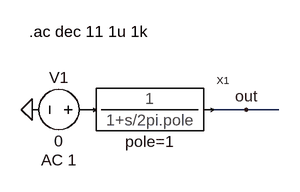
[diagram p0: schematic tb_pole.asc]
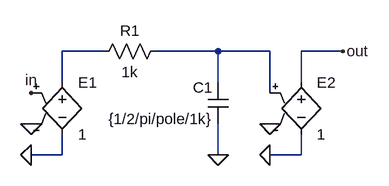
[diagram p1: sub-circuit pole.asc]
tb_pole.asc, the LTspice schematic file:
Version 4
SHEET 1 880 680
WIRE 176 112 128 112
WIRE 224 112 176 112
FLAG -144 112 0
FLAG 176 112 out
SYMBOL pole 32 112 R0
SYMATTR InstName X1
SYMBOL voltage -48 112 R90
WINDOW 0 -32 56 VBottom 2
WINDOW 3 32 56 VTop 2
WINDOW 123 60 56 VTop 2
WINDOW 39 0 0 Left 2
SYMATTR InstName V1
SYMATTR Value 0
SYMATTR Value2 AC 1
TEXT -148 -4 Left 2 !.ac dec 11 1u 1k

pole.asc, the sub-circuit schematic file:
Version 4
SHEET 1 880 680
WIRE 304 64 240 64
WIRE 480 64 384 64
WIRE 560 64 480 64
WIRE 672 64 608 64
WIRE 240 112 240 64
WIRE 480 112 480 64
WIRE 608 112 608 64
WIRE 560 128 560 64
WIRE 240 224 240 192
WIRE 240 224 192 224
WIRE 480 224 480 176
WIRE 608 224 608 192
WIRE 608 224 560 224
FLAG 192 128 in
FLAG 192 224 0
FLAG 672 64 out
FLAG 192 176 0
FLAG 480 224 0
FLAG 560 224 0
FLAG 560 176 0
SYMBOL e 240 96 R0
SYMATTR InstName E1
SYMATTR Value 1
SYMBOL res 400 48 R90
WINDOW 0 0 56 VBottom 2
WINDOW 3 32 56 VTop 2
SYMATTR InstName R1
SYMATTR Value 1k
SYMBOL cap 496 176 R180
WINDOW 0 24 56 Left 2
WINDOW 3 24 8 Left 2
SYMATTR InstName C1
SYMATTR Value {1/2/pi/pole/1k}
SYMBOL e 608 96 R0
SYMATTR InstName E2
SYMATTR Value 1

The netlist it stands for:
* tb_pole.asc
XX1 P001 out pole params: pole=1
V1 P001 0 0 AC 1

* block symbol definitions
.subckt pole in out
E1 N001 0 in 0 1
R1 N002 N001 1k
C1 0 N002 {1/2/pi/pole/1k}
E2 out 0 N002 0 1
.ends pole

.ac dec 11 1u 1k
.backanno
.end